# Altium schematic sheet ICSP.SchDoc: ICSP
size Letter; Date: 2017-02-06; DocumentNumber: 11; Revision: B; SheetNumber: 11; SheetTotal: 16; DesignedBy: Craig Comberbach
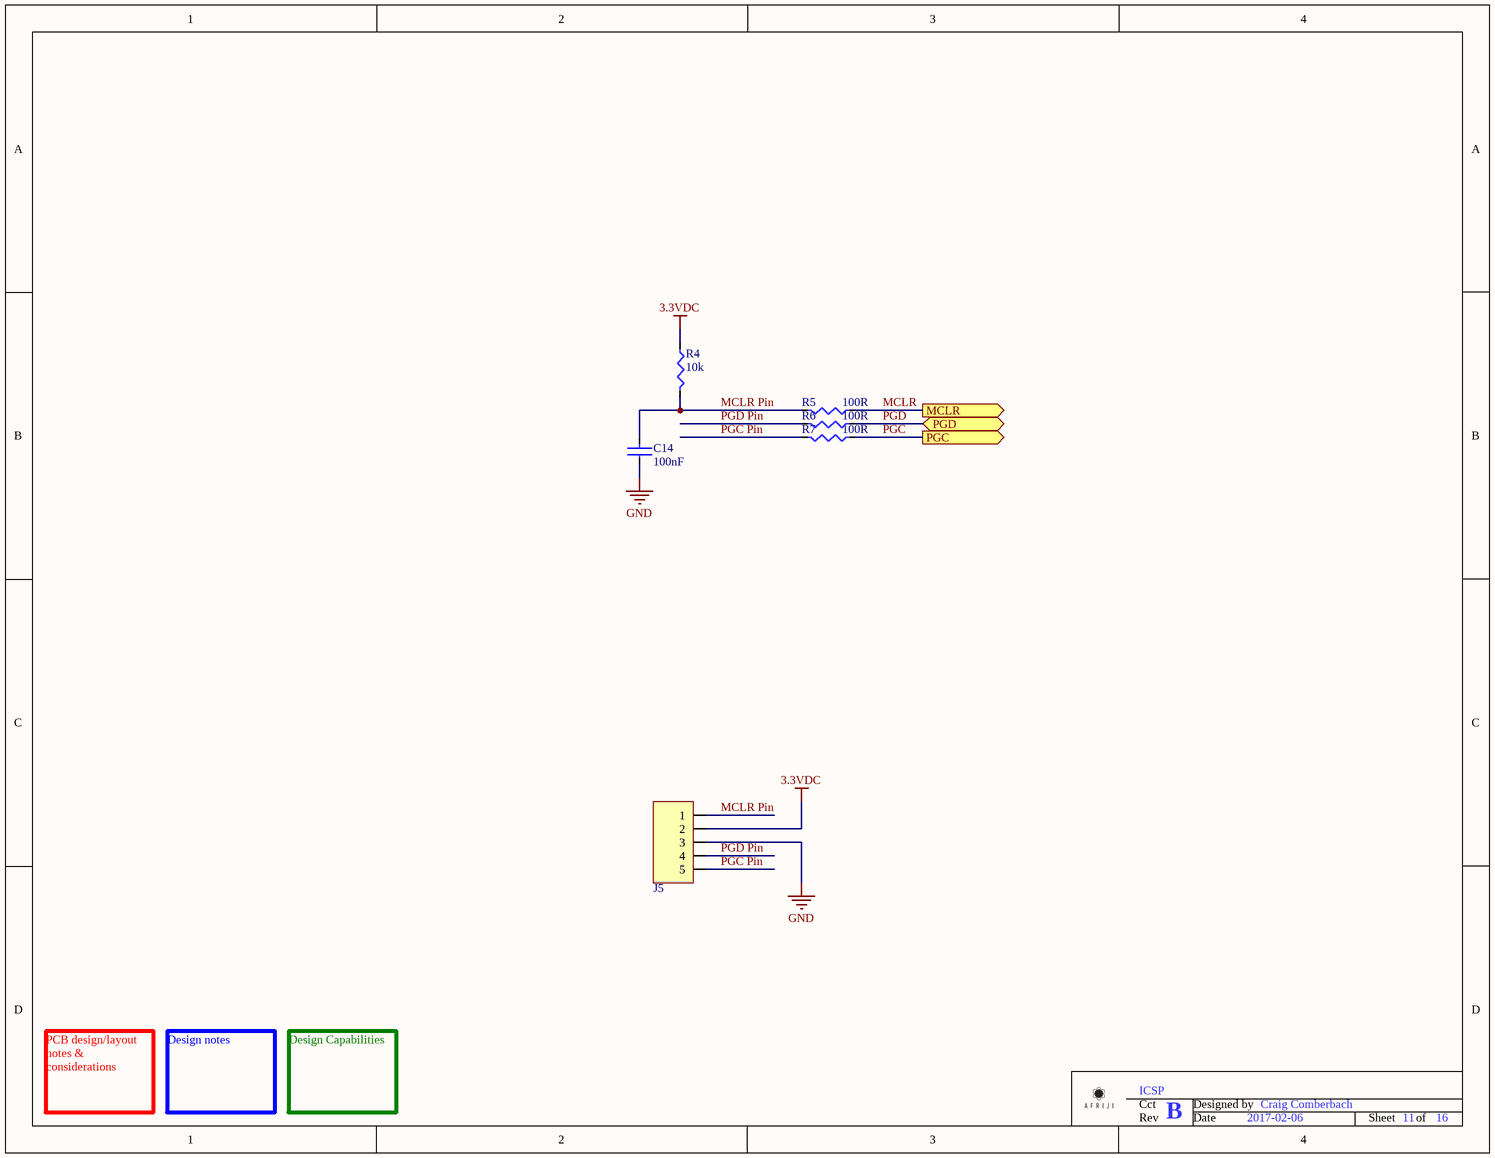
[diagram p0: ICSP.SchDoc]

## Parts
C14  Capacitance: 100nF  [C0603 - Ceramic]  (hidden comment: 100nF 0603 50V)
J5  MTA100 - 5-Pin with friction Lock  [Connector - MTA-100 5 Position]  (value not drawn)
R4  Resistance (Ohms): 10k  [R0603]  (hidden comment: 10k 0603 1%)
R5  Resistance (Ohms): 100R  [R0603]  (hidden comment: 100R 0603 1%)
R6  Resistance (Ohms): 100R  [R0603]  (hidden comment: 100R 0603 1%)
R7  Resistance (Ohms): 100R  [R0603]  (hidden comment: 100R 0603 1%)

## Ports
MCLR (out), PGC (out), PGD (bidir)

## Nets
3.3VDC: J5.2 R4.1
GND: C14.2 J5.3
MCLR: R5.2 ; port MCLR
MCLR Pin: C14.1 J5.1 R4.2 R5.1
PGC: R7.2 ; port PGC
PGC Pin: J5.5 R7.1
PGD: R6.2 ; port PGD
PGD Pin: J5.4 R6.1

## Notes on the sheet
- PCB design/layout notes & considerations
- Design notes
- Design Capabilities
- Cct
- Designed by
- Rev
- Date
- Sheet
- of

## Library data of the parts
C14 = 100nF 0603 50V: Manufacturer: Samsung Electro-Mechanics America, Inc; Manufacturer Part Number: CL10B104KB8SFNC; Tolerance: ±10%; Temperature Coefficient: X7R; Value: 100nF 0603 50V; Supplier 1: Digi-Key; RoHS: RoHS Compliant; Category: Capacitors; Stock 1: 1192070; Pricing 1: 1=0.1, 10=0.027, 25=0.0192, 100=0.0125, 500=0.00874, 1000=0.00681 (USD); Packaging: Cut Tape (CT); Voltage - Rated: 50V; Mounting Type: Surface Mount, MLCC; Operating Temperature: -55°C ~ 125°C; Applications: Boardflex Sensitive; Ratings: -; Package / Case: 0603 (1608 Metric); Size / Dimension: 0.063" L x 0.031" W (1.60mm x 0.80mm); Height - Seated (Max): -; Thickness (Max): 0.035" (0.90mm); Lead Spacing: -; Features: Soft Termination; Lead Style: -; ComponentLink1URL: http://www.samsungsem.com/kr/front/downloadcms.do?path=/kr/support/product-search/mlcc/__icsFiles/afieldfile/2014/11/05&fileName=S_CL10B104KB8SFNC.pdf; ComponentLink1Description: http://www.samsungsem.com/kr/front/downloadcms.do?path=/kr/support/product-search/mlcc/__icsFiles/afieldfile/2014/11/05&fileName=S_CL10B104KB8SFNC.pdf; Supplier Part Number 1: 1276-1936-1-ND
J5 = MTA100 - 5-Pin with friction Lock: Flash Programmer; Manufacturer: TE Connectivity; Manufacturer Part Number: 640456-5; Connector Type: Header, Unshrouded; Number of Positions: 5; Number of Positions Loaded: All; Pitch: 0.100" (2.54mm); Supplier 1: Digi-Key; Supplier Part Number 1: A19471-ND; RoHS: RoHS Compliant; Category: Connectors, Interconnects; Stock 1: 38829; Pricing 1: 1=0.34, 10=0.314, 50=0.2286, 100=0.2197, 250=0.1972, 500=0.18824, 1000=0.15687, 2500=0.14343, 5000=0.13446 (CAD); Packaging: Bulk; Contact Type: Male Pin; Number of Rows: 1; Row Spacing: -; Contact Mating Length: 0.295" (7.49mm); Mounting Type: Through Hole; Termination: Solder; Fastening Type: Friction Lock; Features: -; Contact Finish: Tin; Contact Finish Thickness: -; Color: Natural; ComponentLink1URL: http://www.te.com/commerce/DocumentDelivery/DDEController?Action=srchrtrv&DocNm=640456&DocType=Customer+Drawing&DocLang=English; ComponentLink1Description: Spec Sheet; Technology: THT; Value: MTA100 - 5-Pin with friction Lock
R4 = 10k 0603 1%: Resistor; Manufacturer: Yageo; Manufacturer Part Number: RC0603FR-0710KL; Power (Watts): 0.1W, 1/10W; Temperature Coefficient: ±100ppm/°C; Value: 10k 0603 1%; Supplier 1: Digi-Key; RoHS: RoHS Compliant; Category: Resistors; Stock 1: 5171799; Pricing 1: 1=0.1, 10=0.015, 25=0.0108, 100=0.006, 250=0.00456, 500=0.00364, 1000=0.00268, 2500=0.00233 (USD); Packaging: Cut Tape (CT); Tolerance: ±1%; Composition: Thick Film; Features: Moisture Resistant; Package / Case: 0603 (1608 Metric); Supplier Device Package: 0603; Size / Dimension: 0.063" L x 0.031" W (1.60mm x 0.80mm); Height: 0.022" (0.55mm); Number of Terminations: 2; ComponentLink1URL: http://www.yageo.com/NewPortal/yageodocoutput?fileName=/pdf/R-Chip/PYu-RC_Group_51_RoHS_L_0.pdf; ComponentLink1Description: http://www.yageo.com/NewPortal/yageodocoutput?fileName=/pdf/R-Chip/PYu-RC_Group_51_RoHS_L_0.pdf; Supplier Part Number 1: 311-10.0KHRCT-ND; Operating Temperature: -55°C ~ 155°C
R5-R7 = 100R 0603 1%: 1/8W; Manufacturer: Yageo; Manufacturer Part Number: RC0603FR-07100RL; Power (Watts): 0.1W, 1/10W; Temperature Coefficient: ±100ppm/°C; Value: 100R 0603 1%; Supplier 1: Digi-Key; RoHS: RoHS Compliant; Category: Resistors; Stock 1: 2116183; Pricing 1: 1=0.1, 10=0.015, 25=0.0108, 100=0.006, 250=0.00456, 500=0.00364, 1000=0.00268, 2500=0.00233 (USD); Packaging: Cut Tape (CT); Tolerance: ±1%; Composition: Thick Film; Features: Moisture Resistant; Package / Case: 0603 (1608 Metric); Supplier Device Package: 0603; Size / Dimension: 0.063" L x 0.031" W (1.60mm x 0.80mm); Height: 0.022" (0.55mm); Number of Terminations: 2; ComponentLink1URL: http://www.yageo.com/NewPortal/yageodocoutput?fileName=/pdf/R-Chip/PYu-RC_Group_51_RoHS_L_0.pdf; ComponentLink1Description: http://www.yageo.com/NewPortal/yageodocoutput?fileName=/pdf/R-Chip/PYu-RC_Group_51_RoHS_L_0.pdf; Supplier Part Number 1: 311-100HRCT-ND; Operating Temperature: -55°C ~ 155°C